# EAGLE schematic discriminator (EAGLE 8.4.1)
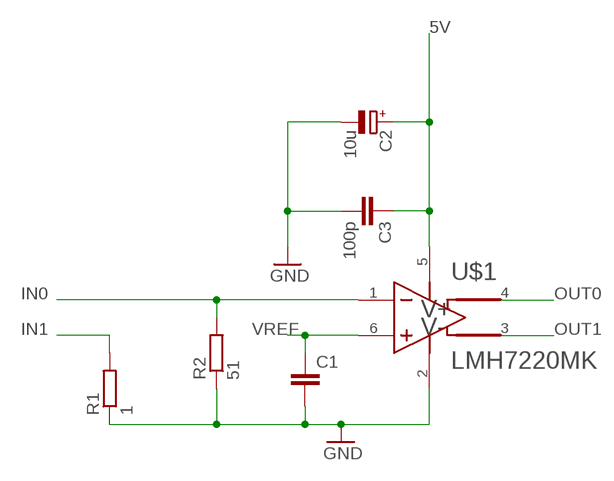
[diagram p0: schematic, sheet 1]

## Parts
C1  C-EUC2012  [C2012]
C2  10u  CPOL-EUCT3528  [CT3528]
C3  100p  C-EUC2012  [C2012]
R1  1  R-EU_R0805  [R0805]
R2  51  R-EU_R0805  [R0805]
U$1  LMH7220MK  [TSOP-6.PAC]

## Nets
5V: C2.+ C3.1 U$1.5(V+)
GND: C1.2 C2.- C3.2 R1.1 R2.1 U$1.2(V-)
IN0: R2.2 U$1.1(-IN)
IN1: R1.2
OUT0: U$1.4(+OUT)
OUT1: U$1.3(-OUT)
VREF: C1.1 U$1.6(+IN)

## Library data of the parts
C1 C3 = rcl:C-EU: CAPACITOR, European symbol
C2 = rcl:CPOL-EU: POLARIZED CAPACITOR, European symbol
R1 R2 = rcl:R-EU_: RESISTOR, European symbol
U$1 = LMH7220:LMH7220MK